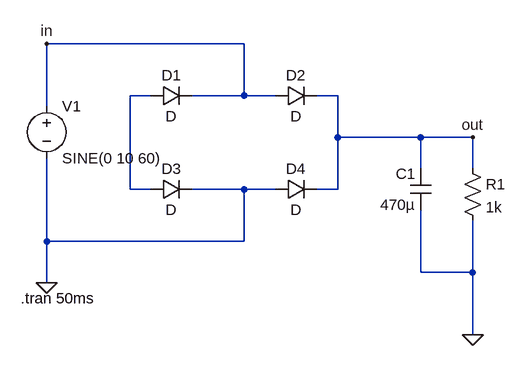
[diagram p0: schematic Assignment 3.2 Schemetic 3.asc]
Assignment 3.2 Schemetic 3.asc, the LTspice schematic file:
Version 4.1
SHEET 1 880 680
WIRE 288 -16 -16 -16
WIRE 144 64 112 64
WIRE 288 64 288 -16
WIRE 288 64 208 64
WIRE 336 64 288 64
WIRE 432 64 400 64
WIRE -16 80 -16 -16
WIRE 432 128 432 64
WIRE 560 128 432 128
WIRE 640 128 560 128
WIRE 560 176 560 128
WIRE 640 176 640 128
WIRE 112 208 112 64
WIRE 144 208 112 208
WIRE 288 208 208 208
WIRE 336 208 288 208
WIRE 432 208 432 128
WIRE 432 208 400 208
WIRE -16 288 -16 160
WIRE 288 288 288 208
WIRE 288 288 -16 288
WIRE 560 336 560 240
WIRE 640 336 640 256
WIRE 640 336 560 336
WIRE -16 352 -16 288
WIRE 640 432 640 336
FLAG -16 352 0
FLAG -16 -16 in
FLAG 640 432 0
FLAG 640 128 out
SYMBOL diode 144 80 R270
WINDOW 0 32 32 VTop 2
WINDOW 3 0 32 VBottom 2
SYMATTR InstName D1
SYMBOL diode 336 80 R270
WINDOW 0 32 32 VTop 2
WINDOW 3 0 32 VBottom 2
SYMATTR InstName D2
SYMBOL diode 144 224 R270
WINDOW 0 32 32 VTop 2
WINDOW 3 0 32 VBottom 2
SYMATTR InstName D3
SYMBOL diode 336 224 R270
WINDOW 0 32 32 VTop 2
WINDOW 3 0 32 VBottom 2
SYMATTR InstName D4
SYMBOL voltage -16 64 R0
WINDOW 123 0 0 Left 0
WINDOW 39 0 0 Left 0
SYMATTR InstName V1
SYMATTR Value SINE(0 10 60)
SYMBOL res 624 160 R0
SYMATTR InstName R1
SYMATTR Value 1k
SYMBOL cap 576 240 R180
WINDOW 0 24 56 Left 2
WINDOW 3 24 8 Left 2
SYMATTR InstName C1
SYMATTR Value 470µ
TEXT -56 376 Left 2 !.tran 50ms

The netlist it stands for:
* Assignment 3.2 Schemetic 3.asc
D1 N001 in D
D2 in out D
D3 N001 0 D
D4 0 out D
V1 in 0 SINE(0 10 60)
R1 out 0 1k
C1 0 out 470µ
.model D D
.lib standard.dio
.tran 50ms
.backanno
.end